# EAGLE design Beta22_fettran (EAGLE 9.3.1)
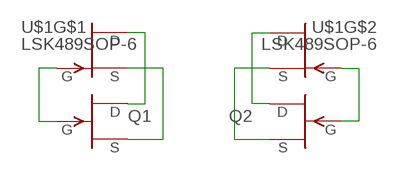
[diagram p0: schematic, sheet 1]

## Parts
Q1  2SK170  [TO92-]
Q2  2SK170  [TO92-]
U$1  LSK489SOP-6  [SOT-23-6]

## Nets
N$1: Q1.2(G) U$1.1(G)
N$2: Q1.3(S) U$1.3(S)
N$3: Q1.1(D) U$1.2(D)
N$4: Q2.1(D) U$1.5(D)
N$5: Q2.3(S) U$1.6(S)
N$6: Q2.2(G) U$1.4(G)

## Library data of the parts
Q1 Q2 = tranzistory FET:2SK170: N-Channel Junction FET
U$1 = Vwvwbg:LSK489

## Board
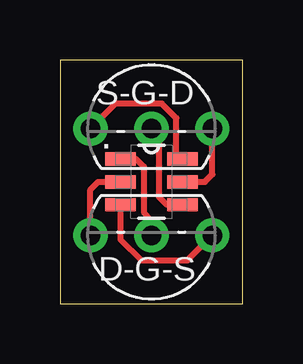
[diagram p1: board, top side]

Size 7.62 x 10.16 mm. Coordinates in mm from the lower left corner, seen from the top.
Outline: 0,0 7.62,0 7.62,10.16 0,10.16 0,0
Copper layers (1*16): Top 0.035mm / dielectric 1.5mm / Bottom 0.035mm
Design rules "default *": minimum track width 10mil, minimum drill 24mil, track to track 8mil, track to pad 8mil, pad to pad 8mil, via to via 8mil, smd to smd 8mil, copper to edge 8mil, drill to drill 8mil, minimum pad ring 10mil, minimum via ring 8mil, stop-mask expansion 4mil, vias tented up to drill 0mil, thermal gap 15mil

### Footprints (pad centres in the part's own frame; a part is rotated, then mirrored left to right if it is on the bottom)
TO92- = drill 0.813 pad 1.422: 1 2.54,0; 2 0,0; 3 -2.54,0
SOT-23-6 = smd 1.27 x 0.559: 1 -1.295,0.95; 2 -1.295,0; 3 -1.295,-0.95; 4 1.295,-0.95; 5 1.295,0; 6 1.295,0.95

### Placement (x,y rotation side)
Q1  3.81,2.86 180 top
Q2  3.81,7.3 0 top
U$1  3.81,5.08 0 top

### Tracks (layer width: path | path; a pad name or v marks a point on that pad's centre or on a via)
N$1
  Top 0.254: Q1.2 3.81,3.49 3.49,3.81 3.49,5.71 3.17,6.03 U$1.1
N$2
  Top 0.254: Q1.3 5.31,1.82 3.38,1.82 2.52,2.68 U$1.3
N$3
  Top 0.254: U$1.2 1.59,5.08 1.27,4.76 Q1.1
N$4
  Top 0.254: U$1.5 6.03,5.08 6.35,5.4 Q2.1
N$5
  Top 0.254: U$1.6 4.85,6.28 4.85,7.73 4.24,8.34 2.31,8.34 Q2.3
N$6
  Top 0.254: U$1.4 4.44,4.13 4.13,4.45 4.13,6.99 Q2.2

### Text on the board
tPlace: S-G-D | D-G-S